# EAGLE design furby_shield (EAGLE 6.3)
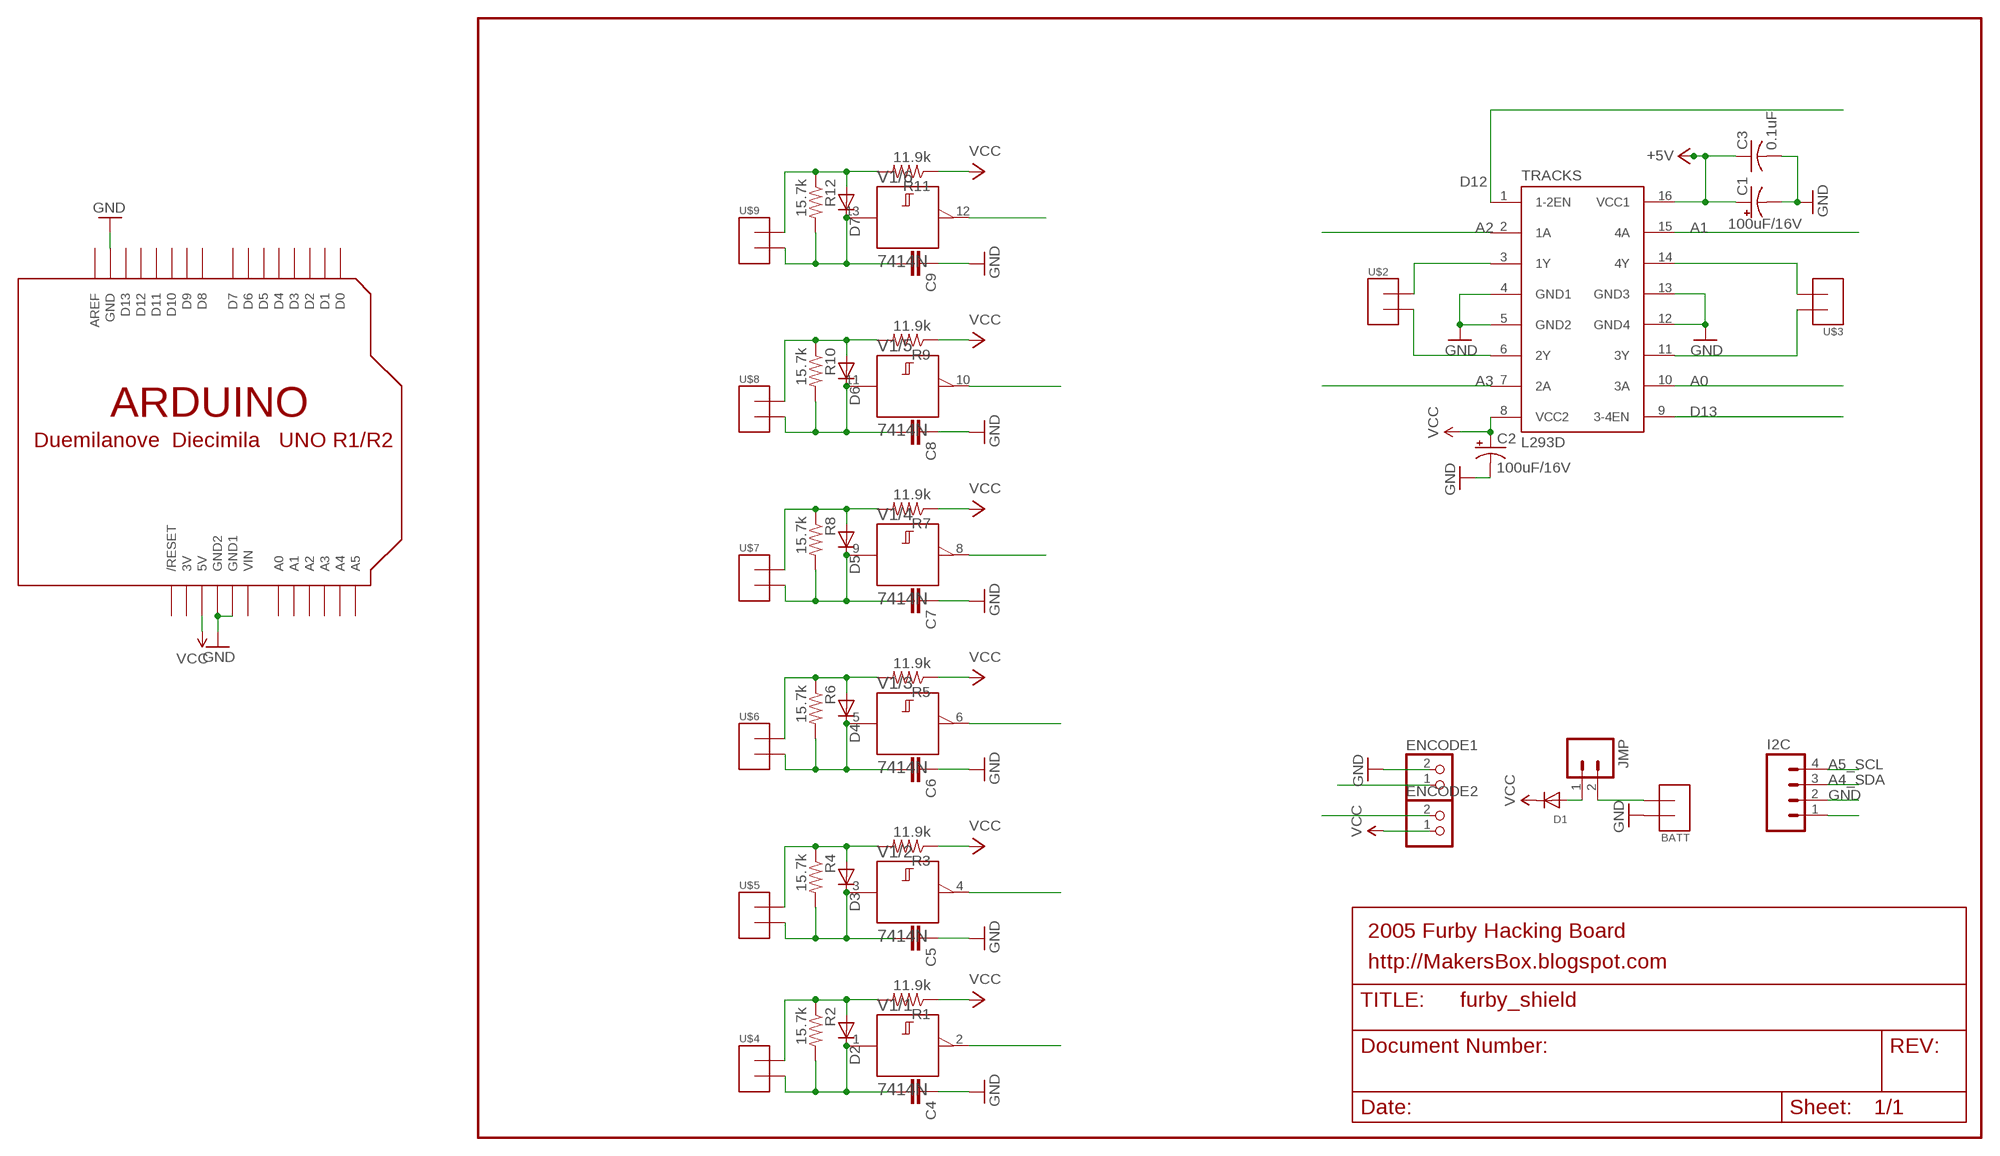
[diagram p0: schematic, sheet 1]

## Parts
BATT  TERMINAL2  [TERMINAL_2]
C1  100uF/16V  CPOL-USE2.5-6  [E2,5-6]
C2  100uF/16V  CPOL-USE2.5-6  [E2,5-6]
C3  0.1uF  C-US025-025X050  [C025-025X050]
C4  CAPPTH  [CAP-PTH-SMALL]
C5  CAPPTH  [CAP-PTH-SMALL]
C6  CAPPTH  [CAP-PTH-SMALL]
C7  CAPPTH  [CAP-PTH-SMALL]
C8  CAPPTH  [CAP-PTH-SMALL]
C9  CAPPTH  [CAP-PTH-SMALL]
D1  DIODEDO-1N4148  [DO-1N4148]
D2  DIODE-D-2.5  [D-2.5]
D3  DIODE-D-2.5  [D-2.5]
D4  DIODE-D-2.5  [D-2.5]
D5  DIODE-D-2.5  [D-2.5]
D6  DIODE-D-2.5  [D-2.5]
D7  DIODE-D-2.5  [D-2.5]
ENCODE1  JST_2PIN-THM  [JST-PH-2-THM]
ENCODE2  JST_2PIN-THM  [JST-PH-2-THM]
I2C  M04PTH  [1X04]
JMP  M02PTH  [1X02]
R1  11.9k  R-US_0204/2V  [0204V]
R2  15.7k  R-US_0204/2V  [0204V]
R3  11.9k  R-US_0204/2V  [0204V]
R4  15.7k  R-US_0204/2V  [0204V]
R5  11.9k  R-US_0204/2V  [0204V]
R6  15.7k  R-US_0204/2V  [0204V]
R7  11.9k  R-US_0204/2V  [0204V]
R8  15.7k  R-US_0204/2V  [0204V]
R9  11.9k  R-US_0204/2V  [0204V]
R10  15.7k  R-US_0204/2V  [0204V]
R11  11.9k  R-US_0204/2V  [0204V]
R12  15.7k  R-US_0204/2V  [0204V]
TRACKS  L293D  L293E  [DIL16]
U$1  ARDUINO-BPLACE  [ARDUINO-BPLACE]
U$2  TERMINAL2  [TERMINAL_2]
U$3  TERMINAL2  [TERMINAL_2]
U$4  TERMINAL2  [TERMINAL_2]
U$5  TERMINAL2  [TERMINAL_2]
U$6  TERMINAL2  [TERMINAL_2]
U$7  TERMINAL2  [TERMINAL_2]
U$8  TERMINAL2  [TERMINAL_2]
U$9  TERMINAL2  [TERMINAL_2]
V1  7414N  [DIL14]

## Nets
+5V: C1.+ C3.1 TRACKS.16(VCC1)
A0: TRACKS.10(3A)
A1: TRACKS.15(4A)
A2: TRACKS.2(1A)
A3: TRACKS.7(2A)
A4: V1.2(/1:Y)
A4_SDA: I2C.3
A5: V1.8(/4:Y)
A5_SCL: I2C.4
A6: V1.12(/6:Y)
D1: V1.4(/2:Y)
D2: V1.6(/3:Y)
D3: V1.10(/5:Y)
D12: TRACKS.1(1-2EN)
D13: TRACKS.9(3-4EN)
GND [power]: BATT.P$1 C1.- C2.- C3.2 C4.1 C5.1 C6.1 C7.1 C8.1 C9.1 ENCODE1.2 I2C.2 TRACKS.4(GND1) TRACKS.5(GND2) TRACKS.12(GND4) TRACKS.13(GND3) U$1.GND U$1.GND1 U$1.GND2
N$1: I2C.1
N$2: ENCODE1.1
N$3: BATT.P$2 JMP.2
N$4: D1.A JMP.1
N$5: ENCODE2.2
N$6: TRACKS.6(2Y) U$2.P$2
N$7: TRACKS.11(3Y) U$3.P$1
N$8: TRACKS.14(4Y) U$3.P$2
N$9: TRACKS.3(1Y) U$2.P$1
N$10: D2.A R1.2 R2.1 U$4.P$1
N$11: C4.2 D2.C R2.2 U$4.P$2 V1.1(/1:A)
N$12: D3.A R3.2 R4.1 U$5.P$1
N$13: C5.2 D3.C R4.2 U$5.P$2 V1.3(/2:A)
N$14: D4.A R5.2 R6.1 U$6.P$1
N$15: C6.2 D4.C R6.2 U$6.P$2 V1.5(/3:A)
N$16: D5.A R7.2 R8.1 U$7.P$1
N$17: C7.2 D5.C R8.2 U$7.P$2 V1.9(/4:A)
N$18: D6.A R9.2 R10.1 U$8.P$1
N$19: C8.2 D6.C R10.2 U$8.P$2 V1.11(/5:A)
N$20: D7.A R11.2 R12.1 U$9.P$1
N$21: C9.2 D7.C R12.2 U$9.P$2 V1.13(/6:A)
VCC: C2.+ D1.C ENCODE2.1 R1.1 R3.1 R5.1 R7.1 R9.1 R11.1 TRACKS.8(VCC2) U$1.5V
Unconnected: U$1.A0 U$1.A1 U$1.A2 U$1.A3 U$1.A4 U$1.A5 U$1.AREF U$1.D0 U$1.D1 U$1.D2 U$1.D3 U$1.D4 U$1.D5 U$1.D6 U$1.D7 U$1.D8 U$1.D9 U$1.D10 U$1.D11 U$1.D12 U$1.D13 U$1.RESET(/RESET)

## Notes on the sheet
- 2005 Furby Hacking Board
- http://MakersBox.blogspot.com

## Power pins joined to a net without a drawn wire
3V: U$1.3V
+UB: V1.14(/+UB:+UB)
-UB: V1.7(/-UB:-UB)
VIN: U$1.VIN

## Library data of the parts
BATT U$2-U$9 = _my-parts:TERMINAL2
C1 C2 = rcl-ez:CPOL-US: POLARIZED CAPACITOR, American symbol
C3 = rcl-ez:C-US: CAPACITOR, American symbol
C4-C9 = SparkFun:CAP: Capacitor Standard 0603 ceramic capacitor, and 0.1" leaded capacitor.
D1 = adafruit:DIODE: Diode SMADIODE - SMA Surface Mount Package 20V 1A Schottky Diode Digikey: 641-1014-6-ND DO-1N4148 - Through Hole Small Current Diode SOD-123 20V 1 A (.5mV Vf) Schottky Diode - Digikey: MBRX120TPMSCT-ND SOD-323 10V 570mA (.38mV Vf, 3ns) Schottky Diode - Digikey: ZLLS410CT-ND SOD-523 30V 30mA Schottky Diode (RB751S-40TE61) - Digikey: RB751S-40TE61CT-ND SOT23-R/W - SOT23 Package (R = Solder Paste/Reflow Ovens, W = Hand-Soldering) BAT54Film 40V 300mA - Digikey: 497-7162-1-ND
D2-D7 = diode:DIODE-: DIODE
ENCODE1 ENCODE2 = adafruit_mod:JST_2PIN: JST 2-Pin Connectors of various flavors SMT-RA (S2B-PH-SM4) 4UConnector #17311 SMT (B2B-PH-SM4) THM-RA (S2B-PH) THM (B2B-PH)
I2C = SparkFun:M04: Header 4 Standard 4-pin 0.1" header. Use with straight break away headers (SKU : PRT-00116), right angle break away headers (PRT-00553), swiss pins (PRT-00743), machine pins (PRT-00117), and female headers (PRT-00115). Molex polarized connector foot print use with SKU : PRT-08231 with associated crimp pins and housings. 1MM SMD Version SKU: PRT-10208
JMP = SparkFun:M02: Header 2 Standard 2-pin 0.1" header. Use with straight break away headers (SKU : PRT-00116), right angle break away headers (PRT-00553), swiss pins (PRT-00743), machine pins (PRT-00117), and female headers (PRT-00115). Molex polarized connector foot print use with SKU : PRT-08233 with associated crimp pins and housings.
R1-R12 = adafruit:R-US_: RESISTOR, American symbol
TRACKS = texas:L293E: TI DEVICE
U$1 = adafruit:ARDUINO: Arduino Diecimila/Duemilanove Make a shield with ease, this package has all the named pins as well as the two mounting drill holes and an outline of the USB and DC power connector. The outline is on the DIMENSION layer, so if your board house uses it they will cut the outline to match. http://www.ladyada.net/library/pcb/eaglelibrary.html
V1 = 74ttl-din:74*14: Hex schmitt trigger INVERTER

## Net classes
0 default: width 0.203 mm
1 power: width 0.61 mm

## Board
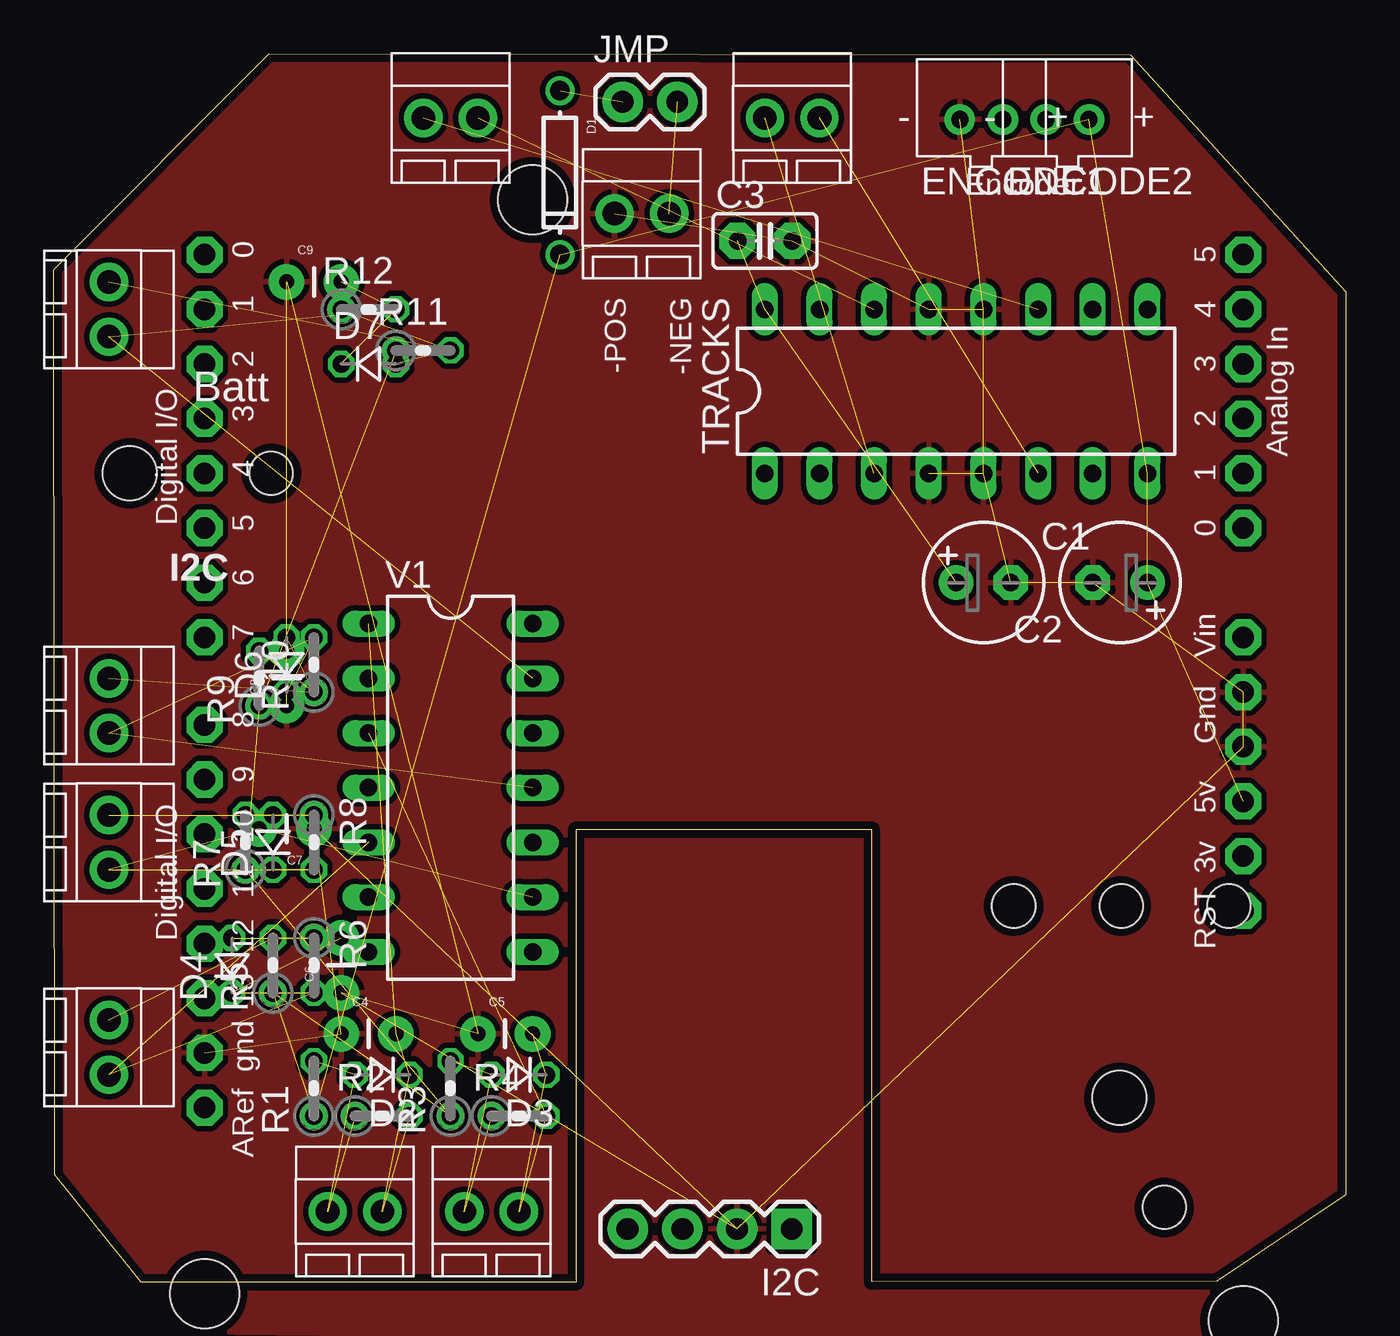
[diagram p1: board, top side]
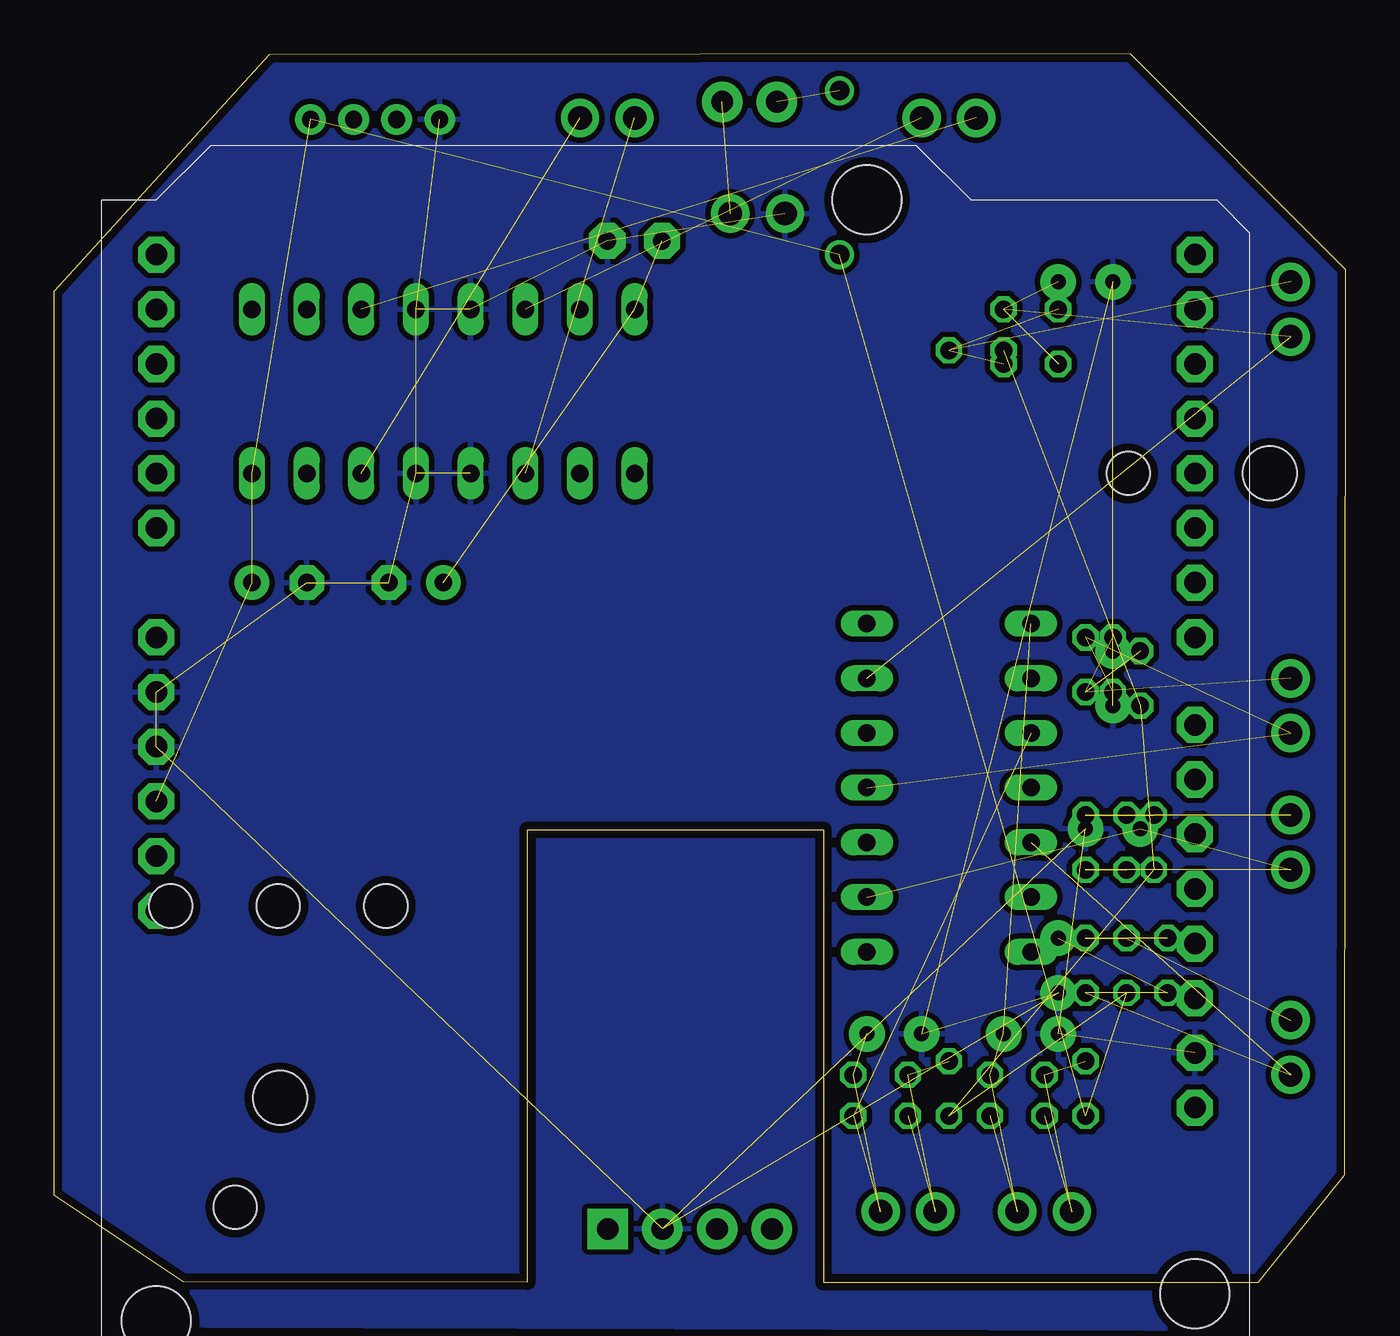
[diagram p2: board, bottom side, seen from below]

Size 60.03 x 57.06 mm. Coordinates in mm from the lower left corner, seen from the top.
Outline: 10.01,57.06 0,47.03 0.05,4.98 4.05,0 24.26,0 24.27,21.01 38.02,21.01 38.02,0.01 54.03,0.05 60.03,4.05 60.03,46.01 50.03,57.01 10,57.05
Copper layers (1*16): Top 0.0356mm / dielectric 1.5011mm / Bottom 0.0356mm
Design rules "LaenPCBOrder": minimum track width 6mil, minimum drill 13mil, track to track 6mil, track to pad 6mil, pad to pad 6mil, via to via 6mil, smd to smd 6mil, copper to edge 15mil, drill to drill 6mil, minimum pad ring 7mil, minimum via ring 7mil, stop-mask expansion 4mil, vias tented up to drill 0mil, thermal gap 10mil
Holes 3.2 mm at 45.44,63.09 40.12,62.42
Holes 2 mm at 10.11,37.57 51.61,3.47 49.61,17.47 54.61,17.47 44.61,17.47
Holes 2.5 mm at 3.52,37.57 49.52,8.57

### Footprints (pad centres in the part's own frame; a part is rotated, then mirrored left to right if it is on the bottom)
TERMINAL_2 = drill 1.1 pad 1.778: P$1 1.27,0; P$2 -1.27,0
E2,5-6 = drill 0.813 pad 1.6: + -1.27,0 | drill 0.813 pad 1.6 octagon: - 1.27,0
C025-025X050 = drill 0.813 pad 1.676 octagon: 1 -1.27,0; 2 1.27,0
CAP-PTH-SMALL = drill 0.7 pad 1.651: 1 0,0; 2 2.54,0
DO-1N4148 = drill 0.9: A -3.81,0; C 3.81,0
D-2.5 = drill 0.813 octagon: A 1.27,0; C -1.27,0
JST-PH-2-THM = drill 0.8 pad 1.422: 1 1,0; 2 -1,0
1X04 = drill 1.016 pad 1.88 square: 1 0,0 | drill 1.016 pad 1.88: 2 2.54,0; 3 5.08,0; 4 7.62,0
1X02 = drill 1.016 pad 1.88: 1 0,0; 2 2.54,0
0204V = drill 0.813 octagon: 1 -1.27,0; 2 1.27,0
DIL16 = drill 0.813 long: 1 -8.89,-3.81; 2 -6.35,-3.81; 3 -3.81,-3.81; 4 -1.27,-3.81; 5 1.27,-3.81; 6 3.81,-3.81; 7 6.35,-3.81; 8 8.89,-3.81; 9 8.89,3.81; 10 6.35,3.81; 11 3.81,3.81; 12 1.27,3.81; 13 -1.27,3.81; 14 -3.81,3.81; 15 -6.35,3.81; 16 -8.89,3.81
ARDUINO-BPLACE = drill 1 pad 1.676 octagon: 3V 35.56,2.54; 5V 38.1,2.54; A0 50.8,2.54; A1 53.34,2.54; A2 55.88,2.54; A3 58.42,2.54; A4 60.96,2.54; A5 63.5,2.54; AREF 23.876,50.8; D0 63.5,50.8; D1 60.96,50.8; D2 58.42,50.8; D3 55.88,50.8; D4 53.34,50.8; D5 50.8,50.8; D6 48.26,50.8; D7 45.72,50.8; D8 41.656,50.8; D9 39.116,50.8; D10 36.576,50.8; D11 34.036,50.8; D12 31.496,50.8; D13 28.956,50.8; GND 26.416,50.8; GND1 43.18,2.54; GND2 40.64,2.54; RESET 33.02,2.54; VIN 45.72,2.54 | hole 3.2: 15.24,50.8; 66.04,35.56; 13.97,2.54
DIL14 = drill 0.813 long: 1 -7.62,-3.81; 2 -5.08,-3.81; 3 -2.54,-3.81; 4 0,-3.81; 5 2.54,-3.81; 6 5.08,-3.81; 7 7.62,-3.81; 8 7.62,3.81; 9 5.08,3.81; 10 2.54,3.81; 11 0,3.81; 12 -2.54,3.81; 13 -5.08,3.81; 14 -7.62,3.81

### Placement (x,y rotation side)
BATT  27.33,49.63 180 top
C1  43.2,32.49 0 top
C2  49.55,32.49 180 top
C3  33.04,48.36 0 top
C4  13.36,11.54 0 top
C5  19.71,11.54 0 top
C6  13.36,13.44 90 top
C7  12.09,21.06 180 top
C8  10.82,26.77 90 top
C9  10.82,46.46 0 top
D1  23.52,51.54 270 top
D2  15.26,9.63 180 top
D3  21.61,9.63 180 top
D4  8.28,14.71 90 top
D5  10.18,20.42 90 top
D6  10.82,28.68 90 top
D7  14.63,42.65 0 top
ENCODE1  43.1,54.01 0 top
ENCODE2  47.1,54.01 0 top
I2C  34.29,2.47 180 top
JMP  26.43,54.82 0 top
R1  12.09,9 90 top
R2  15.26,7.72 0 top
R3  18.44,9 90 top
R4  21.61,7.72 0 top
R5  10.18,14.71 90 top
R6  12.09,14.71 270 top
R7  8.91,20.42 90 top
R8  12.09,20.42 270 top
R9  9.55,28.05 90 top
R10  12.09,28.68 90 top
R11  17.17,43.28 0 top
R12  14.63,45.19 0 top
TRACKS  41.93,41.38 0 top
U$1  57.81,-15.77 90 top
U$2  34.31,54.08 180 top
U$3  18.44,54.08 180 top
U$4  13.99,3.28 180 top
U$5  20.34,3.28 180 top
U$6  2.56,10.9 90 top
U$7  2.56,20.42 90 top
U$8  2.56,26.77 90 top
U$9  2.56,45.19 90 top
V1  18.44,22.96 270 top

### Tracks (layer width: path | path; a pad name or v marks a point on that pad's centre or on a via)
+5V  (2 unrouted)
GND  (18 unrouted)
  pour Bottom (isolate 0.254): -4.2,59.25 68.6,59.26 67.49,-1.96 -5.13,-2.19
  pour Top (isolate 0.254): -3.14,60.35 68.58,59.22 68.26,-3.05 -3.19,-2.19
N$3  (1 unrouted)
N$4  (1 unrouted)
N$6  (1 unrouted)
N$7  (1 unrouted)
N$8  (1 unrouted)
N$9  (1 unrouted)
N$10  (3 unrouted)
N$11  (4 unrouted)
N$12  (3 unrouted)
N$13  (4 unrouted)
N$14  (3 unrouted)
N$15  (4 unrouted)
N$16  (3 unrouted)
N$17  (4 unrouted)
N$18  (3 unrouted)
N$19  (4 unrouted)
N$20  (3 unrouted)
N$21  (4 unrouted)
VCC  (10 unrouted)

### Text on the board
tPlace: Encoder | Reset | -POS / / -NEG | Batt | I2C
bDocu: Open Source / Hardware | i2c_motor_v2 Jan 2012 / Dawson-Station.blogspot.com / 648.ken@gmail.com